# EAGLE schematic MotionBoard Rev C (EAGLE 7.5.0)

## Sheet 1 of 2
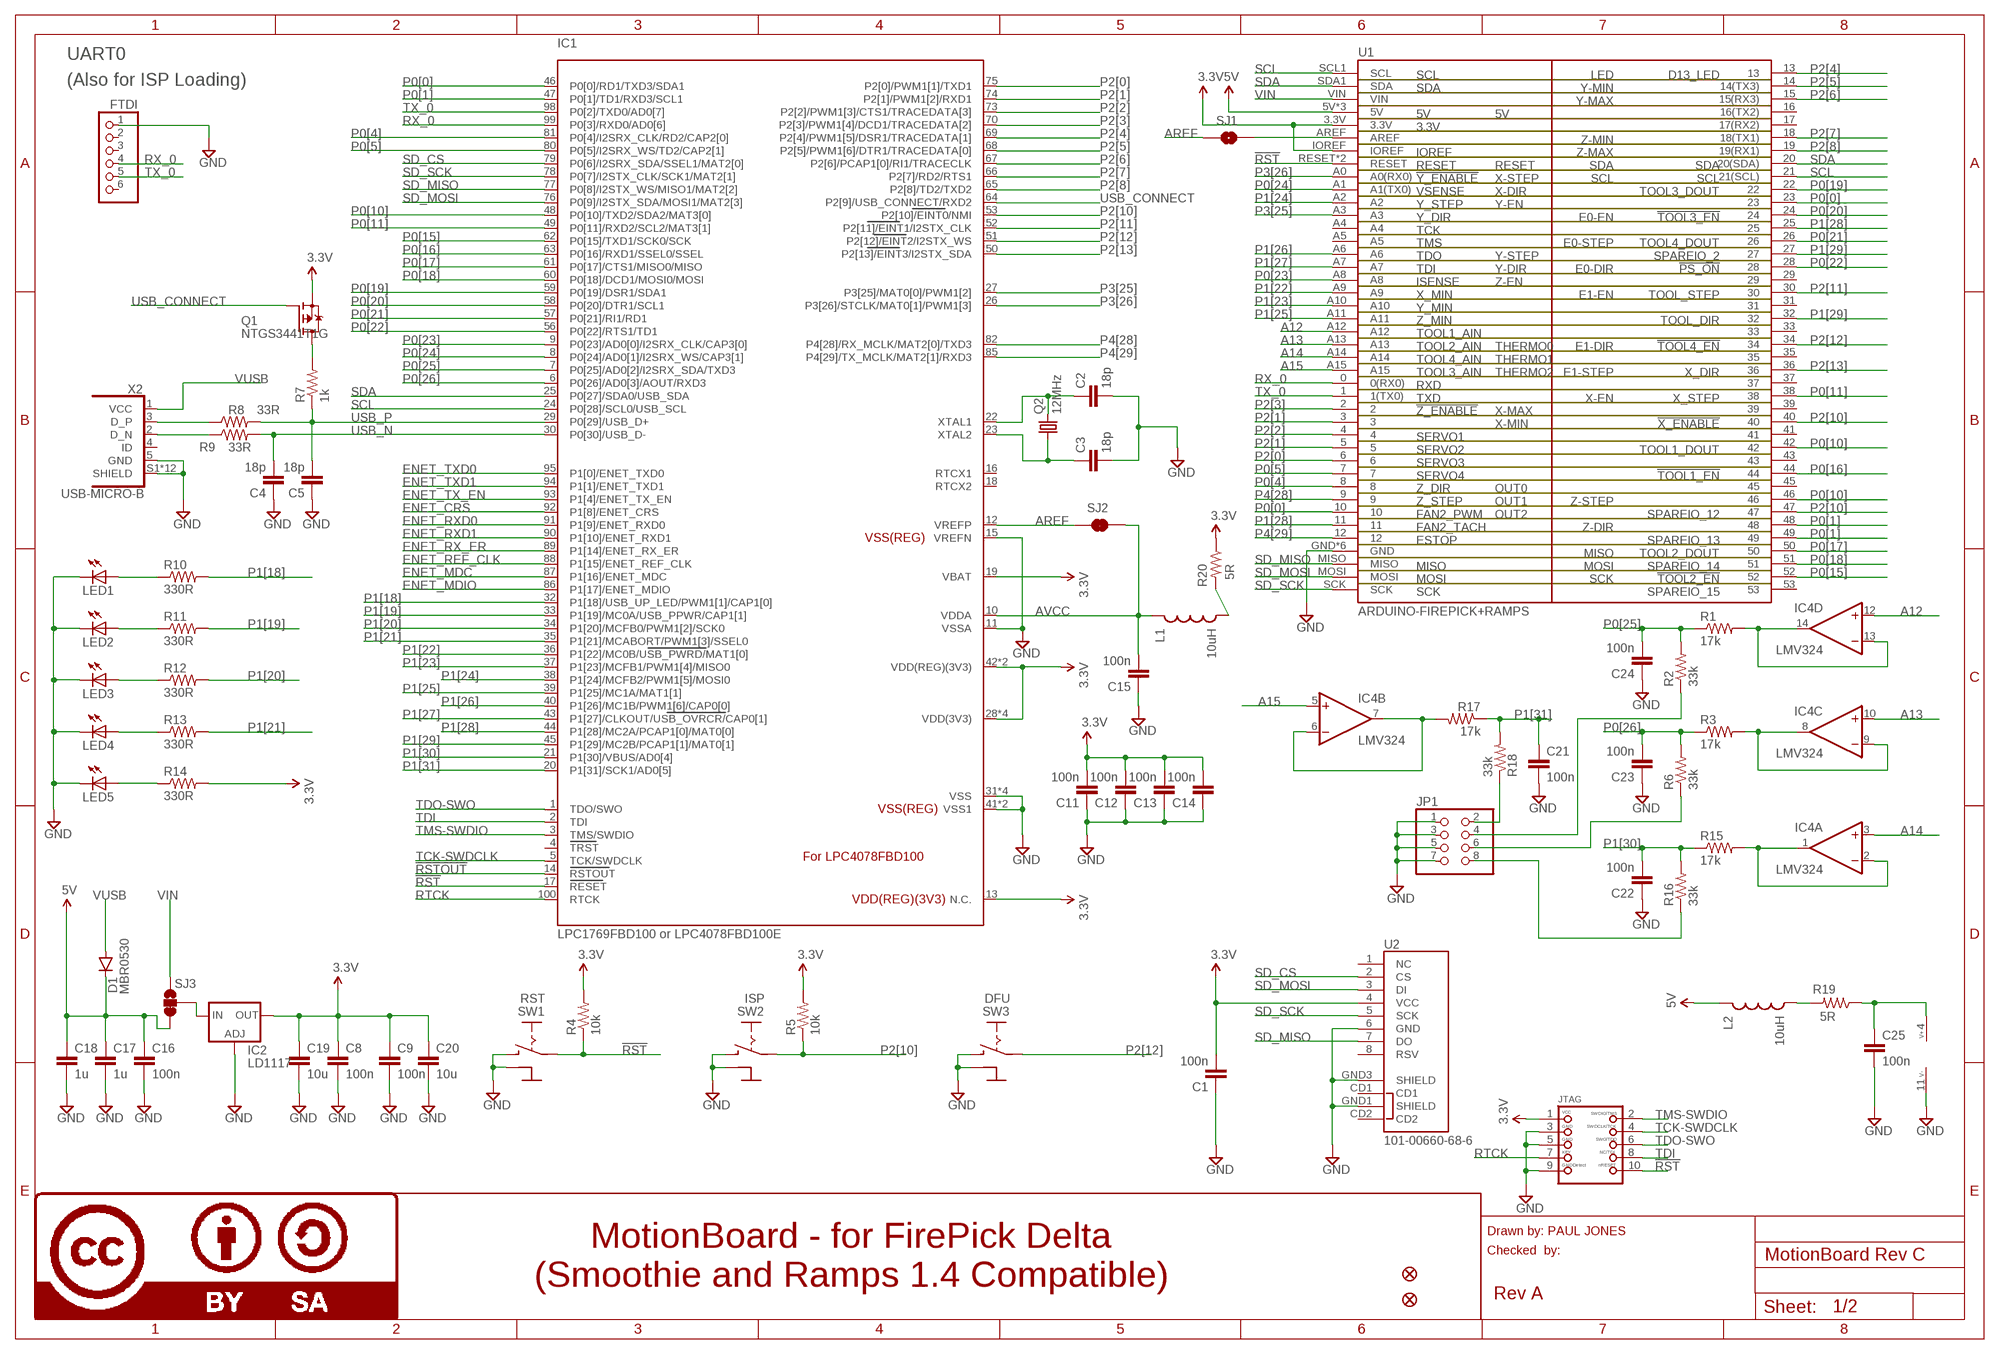
[diagram p0: schematic, sheet 1]

### Parts
C1  100n  CAP0603  [0603]
C2  18p  CAP0603  [0603]
C3  18p  CAP0603  [0603]
C4  18p  CAP0603  [0603]
C5  18p  CAP0603  [0603]
C8  100n  CAP0603  [0603]
C9  100n  CAP0603  [0603]
C11  100n  CAP0603  [0603]
C12  100n  CAP0603  [0603]
C13  100n  CAP0603  [0603]
C14  100n  CAP0603  [0603]
C15  100n  CAP0603  [0603]
C16  100n  CAP0603  [0603]
C17  1u  CAP0603  [0603]
C18  1u  CAP0603  [0603]
C19  10u  CAP0603  [0603]
C20  10u  CAP0603  [0603]
C21  100n  CAP0603  [0603]
C22  100n  CAP0603  [0603]
C23  100n  CAP0603  [0603]
C24  100n  CAP0603  [0603]
C25  100n  CAP0603  [0603]
D1  MBR0530  DIODESOD123  [SOD-123]
DFU  SW3  TOGGLE-SW-SMD  [TOGGLE-SW-SMD]
FID5  FIDUCIAL1X2  [FIDUCIAL-1X2]
FID6  FIDUCIAL1X2  [FIDUCIAL-1X2]
FTDI  PINHD-1X6  [1X06]
IC1  LPC1769FBD100 or LPC4078FBD100E  LPC1768  [LQFP100]
IC2  LD1117  LD117AS12TR  [SOT223]
IC4  LMV324  OPA4743UA  [SO14]
ISP  SW2  TOGGLE-SW-SMD  [TOGGLE-SW-SMD]
JP1  PINHD-2X04_2.54-SMD  [2X04SMD]
JTAG  JTAG-CORTEXM3  [2X05_1.27MM_SMT]
L1  10uH  INDUCTOR0603  [0603]
L2  10uH  INDUCTOR0603  [0603]
LED1  LED  [LED-1206-BOTTOM]
LED2  LED  [LED-1206-BOTTOM]
LED3  LED  [LED-1206-BOTTOM]
LED4  LED  [LED-1206-BOTTOM]
LED5  LED  [LED-1206-BOTTOM]
LOGO6  LOGO-CC-BY-SAMEDIUM  [LOGO-CC-BY-SA-MEDIUM]
Q1  NTGS3441T1G  BSL207SP  [SC74_INFINEON]
Q2  12MHz  CRYSTALHC49UP  [HC49UP]
R1  17k  RESISTOR0603  [0603]
R2  33k  RESISTOR0603  [0603]
R3  17k  RESISTOR0603  [0603]
R4  10k  R-US_R0603  [R0603]
R5  10k  R-US_R0603  [R0603]
R6  33k  RESISTOR0603  [0603]
R7  1k  R-US_R0603  [R0603]
R8  33R  R-US_R0603  [R0603]
R9  33R  R-US_R0603  [R0603]
R10  330R  R-US_R0603  [R0603]
R11  330R  R-US_R0603  [R0603]
R12  330R  R-US_R0603  [R0603]
R13  330R  R-US_R0603  [R0603]
R14  330R  R-US_R0603  [R0603]
R15  17k  RESISTOR0603  [0603]
R16  33k  RESISTOR0603  [0603]
R17  17k  RESISTOR0603  [0603]
R18  33k  RESISTOR0603  [0603]
R19  5R  RESISTOR0603  [0603]
R20  5R  RESISTOR0603  [0603]
RST  SW1  TOGGLE-SW-SMD  [TOGGLE-SW-SMD]
SJ1  JUMPER-PAD-2-NOYES_SILK  [PAD-JUMPER-2-NO_YES_SILK]
SJ2  JUMPER-PAD-2-NC_BY_TRACE  [PAD-JUMPER-2-NC_BY_TRACE_YES_SILK]
SJ3  JUMPER-PAD-3-2OF3_NC_BY_TRACE_SMALL  [PAD-JUMPER-3-2OF3_NC_BY_TRACE_YES_SILK_FULL_BOX]
U1  ARDUINO-FIREPICK+RAMPS  [ARDUINO_MEGA_NEW]
U2  101-00660-68-6  USD-SOCKETNEW  [MICRO-SD-SOCKET-PP]
X2  USB-MICRO-B  [FCI-10118194-0001LF]

### Nets
3.3V: C1.2 C8.1 C9.1 C11.2 C12.2 C13.2 C14.2 C19.1 C20.1 IC1.13(N.C.) IC1.19(VBAT) IC1.28(VDD(3V3)) IC1.42(VDD(REG)(3V3)) IC1.54(VDD(3V3)) IC1.71(VDD(3V3)) IC1.84(VDD(REG)(3V3)) IC1.96(VDD(3V3)) IC2.4(OUT) JTAG.1 Q1.4(S) R4.2 R5.2 R14.2 R20.1 U1.3.3V U1.IOREF U2.4(VCC) ; also sheet 2
5V: C16.1 C17.1 C18.1 D1.C L2.1 SJ3.3 U1.5V U1.5V@1(5V) U1.5V@2(5V)
!RST: IC1.17(RESET) JTAG.10 R4.1 RST.3(I) RST.4(I) U1.RESET U1.RST(RESET)
!RSTOUT: IC1.14(RSTOUT) ; also sheet 2
A12: IC4.12(D:+IN) U1.A12
A13: IC4.10(C:+IN) U1.A13
A14: IC4.3(A:+IN) U1.A14
A15: IC4.5(B:+IN) U1.A15
AREF: IC1.12(VREFP) SJ1.1 SJ2.1
AVCC: C15.2 IC1.10(VDDA) L1.1 SJ2.2
D_N: R9.1 X2.2(D_N)
D_P: R8.1 X2.3(D_P)
ENET_CRS: IC1.92(P1[8]/ENET_CRS) ; also sheet 2
ENET_MDC: IC1.87(P1[16]/ENET_MDC) ; also sheet 2
ENET_MDIO: IC1.86(P1[17]/ENET_MDIO) ; also sheet 2
ENET_REF_CLK: IC1.88(P1[15]/ENET_REF_CLK) ; also sheet 2
ENET_RX_ER: IC1.89(P1[14]/ENET_RX_ER) ; also sheet 2
ENET_RXD0: IC1.91(P1[9]/ENET_RXD0) ; also sheet 2
ENET_RXD1: IC1.90(P1[10]/ENET_RXD1) ; also sheet 2
ENET_TX_EN: IC1.93(P1[4]/ENET_TX_EN) ; also sheet 2
ENET_TXD0: IC1.95(P1[0]/ENET_TXD0) ; also sheet 2
ENET_TXD1: IC1.94(P1[1]/ENET_TXD1) ; also sheet 2
GND: C1.1 C2.2 C3.2 C4.1 C5.1 C8.2 C9.2 C11.1 C12.1 C13.1 C14.1 C15.1 C16.2 C17.2 C18.2 C19.2 C20.2 C21.2 C22.1 C23.1 C24.1 C25.2 DFU.1(C) DFU.2(C) DFU.GND FTDI.1 IC1.11(VSSA) IC1.15(VREFN) IC1.31(VSS) IC1.41(VSS1) IC1.55(VSS) IC1.72(VSS) IC1.83(VSS1) IC1.97(VSS) IC2.1(ADJ) IC4.11(P:V-) ISP.1(C) ISP.2(C) ISP.GND JP1.1 JP1.3 JP1.5 JP1.7 JTAG.3 JTAG.5 JTAG.9 LED1.C LED2.C LED3.C LED4.C LED5.C RST.1(C) RST.2(C) RST.GND U1.GND U1.GND@0(GND) U1.GND@1(GND) U1.GND@2(GND) U1.GND@3(GND) U1.GNDI(GND) U2.6(GND) U2.GND1(SHIELD) U2.GND3(SHIELD) X2.5(GND) X2.S1(SHIELD) X2.S2(SHIELD) X2.S3(SHIELD) X2.S4(SHIELD) X2.S5(SHIELD) X2.S6(SHIELD) X2.S7(SHIELD) X2.S8(SHIELD) X2.S9(SHIELD) X2.S10(SHIELD) X2.S11(SHIELD) X2.S12(SHIELD) ; also sheet 2
N$1: C2.1 IC1.22(XTAL1) Q2.2
N$2: C3.1 IC1.23(XTAL2) Q2.1
N$5: SJ1.2 U1.AREF
N$6: IC4.6(B:-IN) IC4.7(B:OUT) R17.2
N$7: IC2.3(IN) SJ3.2
N$8: JP1.2 R18.1
N$10: IC4.13(D:-IN) IC4.14(D:OUT) R1.2
N$11: JP1.8 R16.1
N$13: IC4.8(C:OUT) IC4.9(C:-IN) R3.2
N$14: JP1.6 R6.1
N$16: IC4.1(A:OUT) IC4.2(A:-IN) R15.2
N$17: JP1.4 R2.1
N$18: C25.1 IC4.4(P:V+) R19.1
N$19: L2.2 R19.2
N$21: L1.2 R20.2
N$51: Q1.1(D) Q1.2(D) Q1.5(D) Q1.6(D) R7.2
N$80: LED5.A R14.1
N$84: LED4.A R13.1
N$85: LED3.A R12.1
N$86: LED2.A R11.1
N$87: LED1.A R10.1
P0[0]: IC1.46(P0[0]/RD1/TXD3/SDA1) U1.10 U1.23
P0[1]: IC1.47(P0[1]/TD1/RXD3/SCL1) U1.48 U1.49
P0[4]: IC1.81(P0[4]/I2SRX_CLK/RD2/CAP2[0]) U1.8
P0[5]: IC1.80(P0[5]/I2SRX_WS/TD2/CAP2[1]) U1.7
P0[10]: IC1.48(P0[10]/TXD2/SDA2/MAT3[0]) U1.42 U1.46
P0[11]: IC1.49(P0[11]/RXD2/SCL2/MAT3[1]) U1.38
P0[15]: IC1.62(P0[15]/TXD1/SCK0/SCK) U1.52
P0[16]: IC1.63(P0[16]/RXD1/SSEL0/SSEL) U1.44
P0[17]: IC1.61(P0[17]/CTS1/MISO0/MISO) U1.50
P0[18]: IC1.60(P0[18]/DCD1/MOSI0/MOSI) U1.51
P0[19]: IC1.59(P0[19]/DSR1/SDA1) U1.22
P0[20]: IC1.58(P0[20]/DTR1/SCL1) U1.24
P0[21]: IC1.57(P0[21]/RI1/RD1) U1.26
P0[22]: IC1.56(P0[22]/RTS1/TD1) U1.28
P0[23]: IC1.9(P0[23]/AD0[0]/I2SRX_CLK/CAP3[0]) U1.A8
P0[24]: IC1.8(P0[24]/AD0[1]/I2SRX_WS/CAP3[1]) U1.A1(A1(TX0))
P0[25]: C24.2 IC1.7(P0[25]/AD0[2]/I2SRX_SDA/TXD3) R1.1 R2.2
P0[26]: C23.2 IC1.6(P0[26]/AD0[3]/AOUT/RXD3) R3.1 R6.2
P1[18]: IC1.32(P1[18]/USB_UP_LED/PWM1[1]/CAP1[0]) R10.2
P1[19]: IC1.33(P1[19]/MC0A/USB_PPWR/CAP1[1]) R11.2
P1[20]: IC1.34(P1[20]/MCFB0/PWM1[2]/SCK0) R12.2
P1[21]: IC1.35(P1[21]/MCABORT/PWM1[3]/SSEL0) R13.2
P1[22]: IC1.36(P1[22]/MC0B/USB_PWRD/MAT1[0]) U1.A9
P1[23]: IC1.37(P1[23]/MCFB1/PWM1[4]/MISO0) U1.A10
P1[24]: IC1.38(P1[24]/MCFB2/PWM1[5]/MOSI0) U1.A2
P1[25]: IC1.39(P1[25]/MC1A/MAT1[1]) U1.A11
P1[26]: IC1.40(P1[26]/MC1B/PWM1[6]/CAP0[0]) U1.A6
P1[27]: IC1.43(P1[27]/CLKOUT/USB_OVRCR/CAP0[1]) U1.A7
P1[28]: IC1.44(P1[28]/MC2A/PCAP1[0]/MAT0[0]) U1.11 U1.25
P1[29]: IC1.45(P1[29]/MC2B/PCAP1[1]/MAT0[1]) U1.27 U1.32
P1[30]: C22.2 IC1.21(P1[30]/VBUS/AD0[4]) R15.1 R16.2
P1[31]: C21.1 IC1.20(P1[31]/SCK1/AD0[5]) R17.1 R18.2
P2[0]: IC1.75(P2[0]/PWM1[1]/TXD1) U1.6
P2[1]: IC1.74(P2[1]/PWM1[2]/RXD1) U1.3 U1.5
P2[2]: IC1.73(P2[2]/PWM1[3]/CTS1/TRACEDATA[3]) U1.4
P2[3]: IC1.70(P2[3]/PWM1[4]/DCD1/TRACEDATA[2]) U1.2
P2[4]: IC1.69(P2[4]/PWM1[5]/DSR1/TRACEDATA[1]) U1.13
P2[5]: IC1.68(P2[5]/PWM1[6]/DTR1/TRACEDATA[0]) U1.14(14(TX3))
P2[6]: IC1.67(P2[6]/PCAP1[0]/RI1/TRACECLK) U1.15(15(RX3))
P2[7]: IC1.66(P2[7]/RD2/RTS1) U1.18(18(TX1))
P2[8]: IC1.65(P2[8]/TD2/TXD2) U1.19(19(RX1))
P2[10]: IC1.53(P2[10]/EINT0/NMI) ISP.3(I) ISP.4(I) R5.1 U1.40 U1.47
P2[11]: IC1.52(P2[11]/EINT1/I2STX_CLK) U1.30
P2[12]: DFU.3(I) DFU.4(I) IC1.51(P2[12]/EINT2/I2STX_WS) U1.34
P2[13]: IC1.50(P2[13]/EINT3/I2STX_SDA) U1.36
P3[25]: IC1.27(P3[25]/MAT0[0]/PWM1[2]) U1.A3
P3[26]: IC1.26(P3[26]/STCLK/MAT0[1]/PWM1[3]) U1.A0(A0(RX0))
P4[28]: IC1.82(P4[28]/RX_MCLK/MAT2[0]/TXD3) U1.9
P4[29]: IC1.85(P4[29]/TX_MCLK/MAT2[1]/RXD3) U1.12
RTCK: IC1.100(RTCK) JTAG.7
RX_0: FTDI.4 IC1.99(P0[3]/RXD0/AD0[6]) U1.0(0(RX0))
SCL: IC1.24(P0[28]/SCL0/USB_SCL) U1.21(21(SCL)) U1.SCL1(SCL)
SD_CS: IC1.79(P0[6]/I2SRX_SDA/SSEL1/MAT2[0]) U2.2(CS)
SD_MISO: IC1.77(P0[8]/I2STX_WS/MISO1/MAT2[2]) U1.MISO U2.7(DO)
SD_MOSI: IC1.76(P0[9]/I2STX_SDA/MOSI1/MAT2[3]) U1.MOSI U2.3(DI)
SD_SCK: IC1.78(P0[7]/I2STX_CLK/SCK1/MAT2[1]) U1.SCK U2.5(SCK)
SDA: IC1.25(P0[27]/SDA0/USB_SDA) U1.20(20(SDA)) U1.SDA1(SDA)
TCK-SWDCLK: IC1.5(TCK/SWDCLK) JTAG.4
TDI: IC1.2(TDI) JTAG.8
TDO-SWO: IC1.1(TDO/SWO) JTAG.6
TMS-SWDIO: IC1.3(TMS/SWDIO) JTAG.2
TX_0: FTDI.5 IC1.98(P0[2]/TXD0/AD0[7]) U1.1(1(TX0))
USB_CONNECT: IC1.64(P2[9]/USB_CONNECT/RXD2) Q1.3(G)
USB_N [USB]: C4.2 IC1.30(P0[30]/USB_D-) R9.2
USB_P [USB]: C5.2 IC1.29(P0[29]/USB_D+) R7.1 R8.2
VIN: SJ3.1 U1.VIN
VUSB: D1.A X2.1(VCC)
Unconnected: FTDI.2 FTDI.3 FTDI.6 IC1.4(TRST) IC1.16(RTCX1) IC1.18(RTCX2) U1.16(16(TX2)) U1.17(17(RX2)) U1.29 U1.31 U1.33 U1.35 U1.37 U1.39 U1.41 U1.43 U1.45 U1.53 U1.A4 U1.A5 U2.1(NC) U2.8(RSV) U2.CD1 U2.CD2 X2.4(ID)

### Notes on the sheet
- UART0
- (Also for ISP Loading)
- Drawn by: PAUL JONES
- MotionBoard - for FirePick Delta
  (Smoothie and Ramps 1.4 Compatible)
- Checked  by:
- Rev A

## Sheet 2 of 2
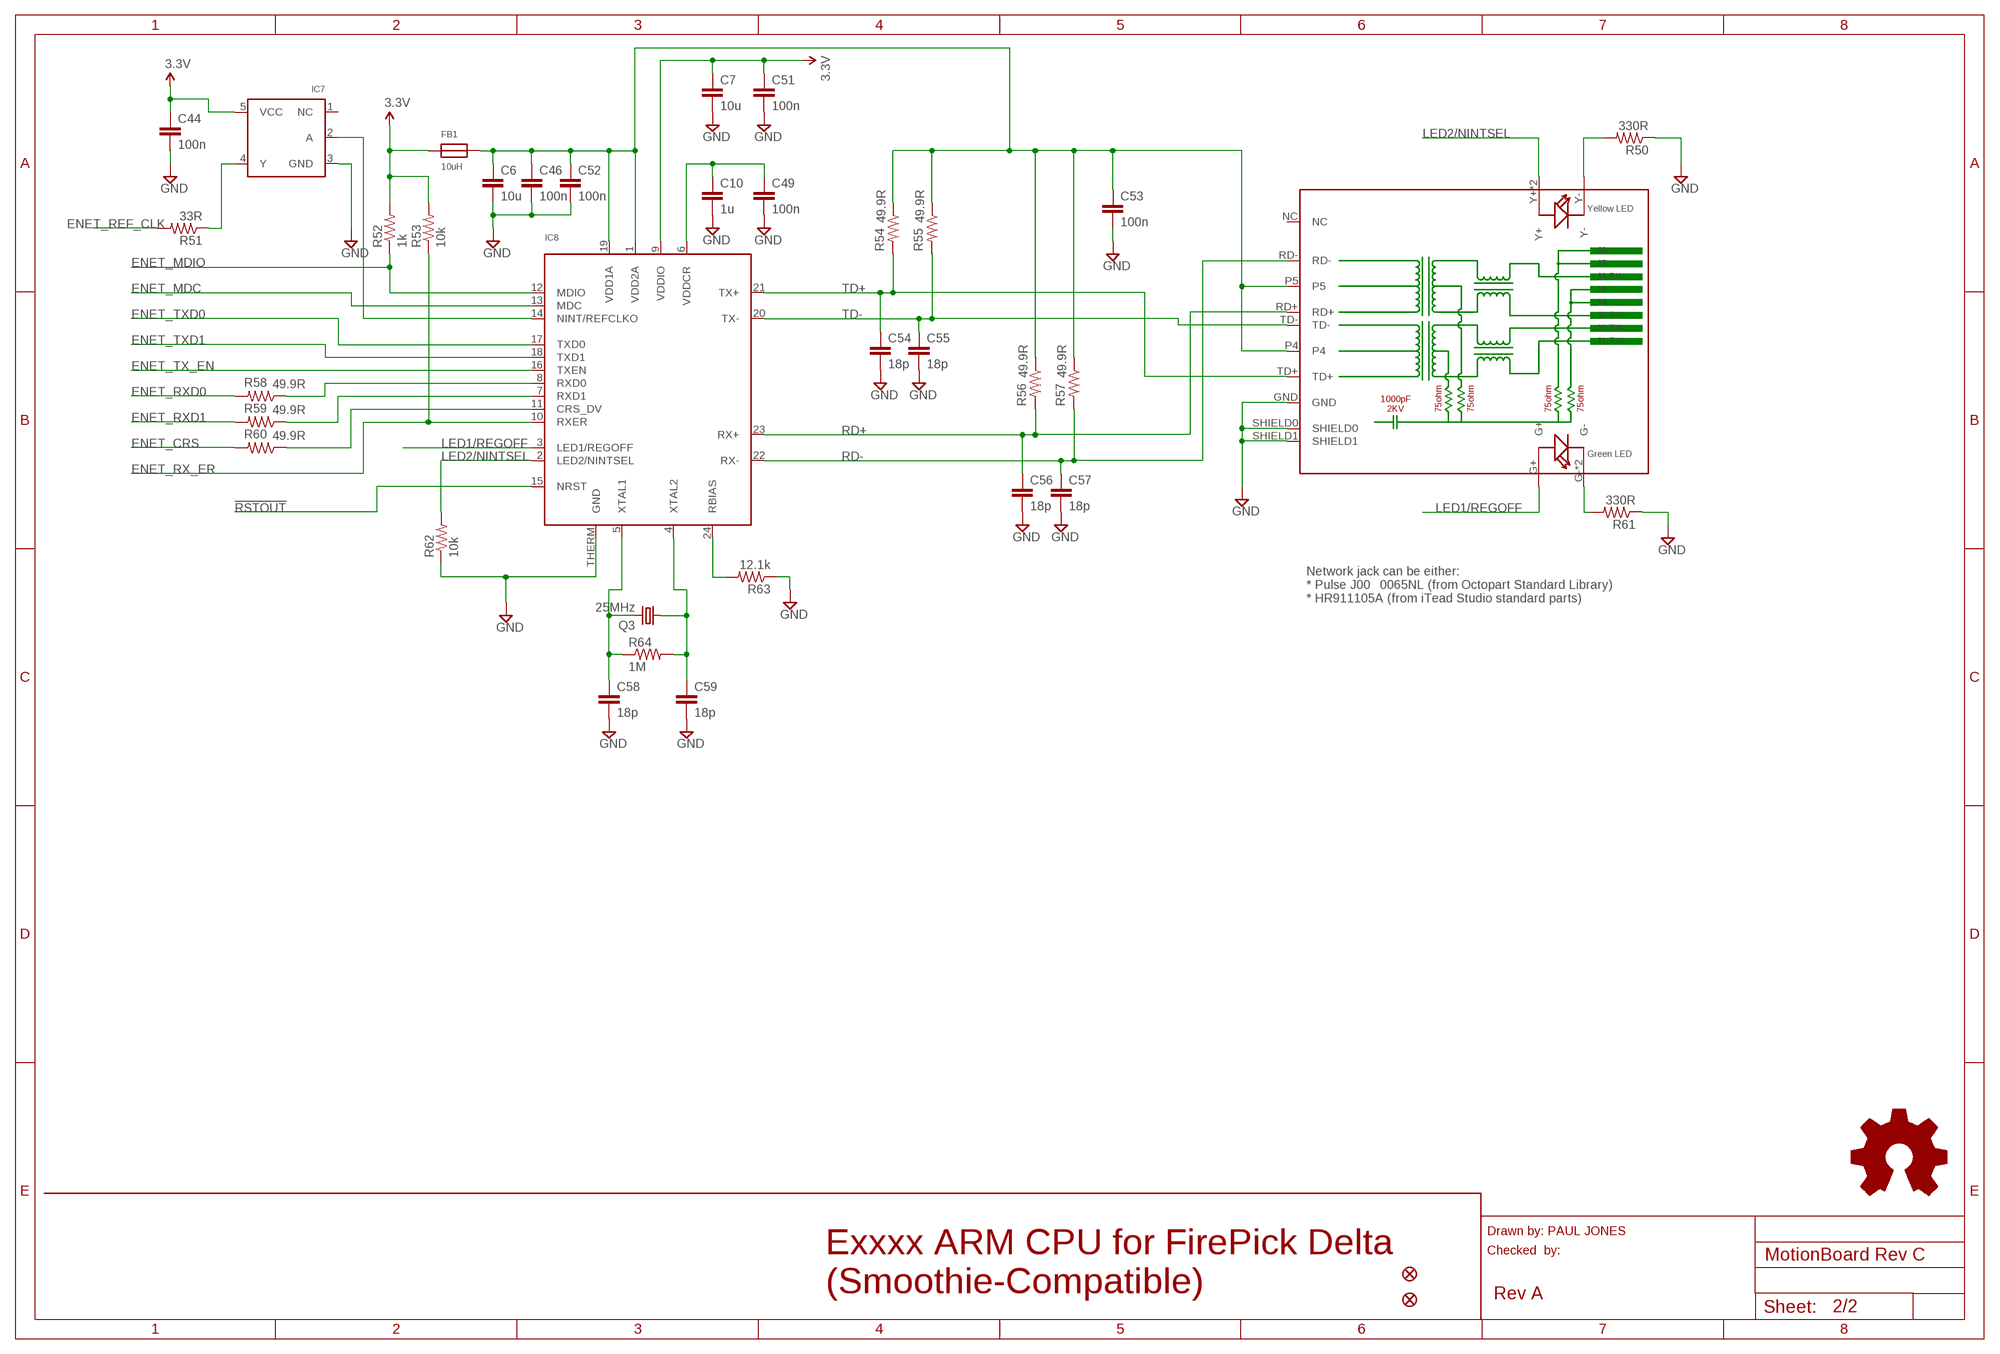
[diagram p1: schematic, sheet 2]

### Parts
C6  10u  CAP0603  [0603]
C7  10u  CAP0603  [0603]
C10  1u  CAP0603  [0603]
C44  100n  CAP0603  [0603]
C46  100n  CAP0603  [0603]
C49  100n  CAP0603  [0603]
C51  100n  CAP0603  [0603]
C52  100n  CAP0603  [0603]
C53  100n  CAP0603  [0603]
C54  18p  CAP0603  [0603]
C55  18p  CAP0603  [0603]
C56  18p  CAP0603  [0603]
C57  18p  CAP0603  [0603]
C58  18p  CAP0603  [0603]
C59  18p  CAP0603  [0603]
FB1  10uH  FERRITE  [0603]
FID17  FIDUCIAL1X2  [FIDUCIAL-1X2]
FID18  FIDUCIAL1X2  [FIDUCIAL-1X2]
IC7  74LVC1G04  [SOT23-5]
IC8  LAN8720  [QFN24_4MM]
LOGO10  LOGO-OSHWSMALL  [LOGO-OSHW-SMALL]
Q3  25MHz  CRYSTALHC49UP  [HC49UP]
R50  330R  R-US_R0603  [R0603]
R51  33R  R-US_R0603  [R0603]
R52  1k  R-US_R0603  [R0603]
R53  10k  R-US_R0603  [R0603]
R54  49.9R  R-US_R0603  [R0603]
R55  49.9R  R-US_R0603  [R0603]
R56  49.9R  R-US_R0603  [R0603]
R57  49.9R  R-US_R0603  [R0603]
R58  49.9R  R-US_R0603  [R0603]
R59  49.9R  R-US_R0603  [R0603]
R60  49.9R  R-US_R0603  [R0603]
R61  330R  R-US_R0603  [R0603]
R62  10k  R-US_R0603  [R0603]
R63  12.1k  R-US_R0603  [R0603]
R64  1M  R-US_R0603  [R0603]
RJ1  HR911105A  [HR911105A]

### Nets
3.3V: C7.1 C44.1 C51.1 FB1.1 IC7.5(VCC) IC8.9(VDDIO) R52.2 R53.2 ; also sheet 1
!RSTOUT: IC8.15(NRST) ; also sheet 1
ENET_CRS: R60.2 ; also sheet 1
ENET_MDC: IC8.13(MDC) ; also sheet 1
ENET_MDIO: IC8.12(MDIO) R52.1 ; also sheet 1
ENET_REF_CLK: R51.2 ; also sheet 1
ENET_RX_ER: IC8.10(RXER) R53.1 ; also sheet 1
ENET_RXD0: R58.2 ; also sheet 1
ENET_RXD1: R59.2 ; also sheet 1
ENET_TX_EN: IC8.16(TXEN) ; also sheet 1
ENET_TXD0: IC8.17(TXD0) ; also sheet 1
ENET_TXD1: IC8.18(TXD1) ; also sheet 1
GND: C6.2 C7.2 C10.2 C44.2 C46.2 C49.2 C51.2 C52.2 C53.2 C54.2 C55.2 C56.2 C57.2 C58.2 C59.2 IC7.3(GND) IC8.THERM(GND) R50.1 R61.1 R62.1 R63.1 RJ1.GND RJ1.SHIELD0 RJ1.SHIELD1 ; also sheet 1
LED1/REGOFF: IC8.3(LED1/REGOFF) RJ1.G+
LED2/NINTSEL: IC8.2(LED2/NINTSEL) R62.2 RJ1.Y+ RJ1.Y++(Y+)
N$3: IC8.11(CRS_DV) R60.1
N$4: IC8.24(RBIAS) R63.2
N$12: C10.1 C49.1 IC8.6(VDDCR)
N$15: IC7.2(A) IC8.14(NINT/REFCLKO)
N$20: R61.2 RJ1.G- RJ1.G--(G-)
N$42: IC8.8(RXD0) R58.1
N$47: R50.2 RJ1.Y-
N$55: IC8.7(RXD1) R59.1
N$67: C59.1 IC8.4(XTAL2) Q3.1 R64.2
N$68: C58.1 IC8.5(XTAL1) Q3.2 R64.1
N$78: IC7.4(Y) R51.1
RD+: C56.1 IC8.23(RX+) R56.2 RJ1.RD+
RD-: C57.1 IC8.22(RX-) R57.2 RJ1.RD-
TD+: C54.1 IC8.21(TX+) R54.2 RJ1.TD+
TD-: C55.1 IC8.20(TX-) R55.2 RJ1.TD-
VDD: C6.1 C46.1 C52.1 C53.1 FB1.2 IC8.1(VDD2A) IC8.19(VDD1A) R54.1 R55.1 R56.1 R57.1 RJ1.P4 RJ1.P5
Unconnected: IC7.1(NC) RJ1.NC

### Notes on the sheet
- Network jack can be either:
  * Pulse J00‑0065NL (from Octopart Standard Library)
  * HR911105A (from iTead Studio standard parts)
- Drawn by: PAUL JONES
- Checked  by:
- Exxxx ARM CPU for FirePick Delta
  (Smoothie-Compatible)
- Rev A

## Library data of the parts
C1-C25 C44 C46 C49 C51-C59 = Paul:CAP: Capacitor Standard 0603 ceramic capacitor, and 0.1" leaded capacitor.
D1 = SparkFun-DiscreteSemi:DIODE: Diode These are standard reverse protection diodes and small signal diodes. SMA package can handle up to about 1A. SOD-323 can handle about 200mA. What the SOD-323 package when ordering, there are some mfgs out there that are 5-pin packages.
DFU ISP RST = Paul:TOGGLE-SW-SMD
FB1 = microbuilder:FERRITE: Ferrite Bead 0603 120 Ohm, 600mA Ferrite Chip - Digikey: 445-2164-1-ND
FID5 FID6 FID17 FID18 = SparkFun-Aesthetics:FIDUCIAL: Fiducial Alignment Points Various fiducial points for machine vision alignment.
FTDI = pinhead:PINHD-1X6: PIN HEADER
IC1 = Paul:LPC1768: LPC1768 100 MHz 32-bit ARM Cortex-M3 based microcontroller featuring a high level of integration and low power consumption. 512 kB Flash, 64 kB SRAM, USB Device/Host/OTG, Ethernet, CAN, I2S, 10-bit DAC Digikey: 568-4796-ND
IC2 = v-reg:LD117A?*: Low drop fixed and adjustable positive voltage regulators 1 A Source: http://www.st.com/stonline/products/literature/ds/7194/ld1117axx.pdf
IC4 = Paul:OPA4743: 12V, 7MHz, CMOS, Rail-to-Rail I/O Quad OP AMP Source: http://focus.ti.com/lit/ds/sbos201/sbos201.pdf
IC7 = microbuilder:74LVC1G04: 74LVC1G04 - Single Inverter Gate SOT23-5 SN74LVC1G04DBVR - Digikey: 296-11599-1-ND
IC8 = microbuilder:LAN8720: LAN8720A 10/100 Ethernet PHY Mouser: 886-LAN8720AI-CP
JP1 = pinhead-2:PINHD-2X04: PIN HEADER
JTAG = microbuilder:JTAG-CORTEXM3: Serial Wire (SW-DP) Connector This standard 0.05" 10-pin connector is for use with the Cortex M0/M3's native SWD (serial wire debugger) interface (SW-DP). Some boards support a 20-pin combined JTAG+SWD connector (SWJ-DP), such as the LPC1700 family, but many smaller devices only work with SWD which typically use the smaller 10-pin SW-DP connecter (the LPC1300 family, for example, only supports SWD). 2x05 1.27mm/0.05" Connector: This is the standard SMT connector defined by ARM for all Cortex devices, and should be used in most situations and for forward-compatibility since any new devices coming to market will likely use this connector. MOLEX 10 Pin 0.1" Connector: This 0.1" 10 pin connector has the same pin layout as the standard 0.05" connector, but is easier to work with if you are using standard jumper wires or custom cables to connect your SWD hardware. MOLEX 20 Pin 0.1" Connector: This 0.1" 20 pin connector is the same model used for ARM7/ARM9 JTAG debuggers, but is connected to match the pins on the Segger J-Link for ARM (which supports both JTAG and SWD debugging). See the following document from ARM for more information on Cortex M3 Debug Connectors: http://infocenter.arm.com/help/topic/com.arm.doc.faqs/attached/13634/cortex_debug_connectors.pdf And the following page for an overview with images of the different connector types: http://www.keil.com/peripherals/coresight/connectors.asp
L1 L2 = SparkFun:INDUCTOR: Inductors Basic Inductor/Choke - 0603 and 1206. Footprints are not proven and vary greatly between part numbers.
LED1-LED5 = Paul:LED: LEDs Standard schematic elements and footprints for 5mm, 3mm, 1206, and 0603 sized LEDs. 5mm - Spark Fun Electronics SKU : COM-00529 (and others)
LOGO6 = FirePick:LOGO-CC-BY-SA
LOGO10 = FirePick:LOGO-OSHW
Q1 = transistor-fet:BSL207SP: OptiMOS(R)-P Small-Signal-Transistor P-Channel, Enhancement mode, Super Logic Level (2.5 V rated) Source: http://www.infineon.com/upload/Document/BSL207SP_Rev2.01.pdf
Q2 Q3 = crystal:CRYSTAL: CRYSTAL; OC_FARNELL: unknown; OC_NEWARK: unknown
R1-R3 R6 R15-R20 = Paul:RESISTOR: Resistor Basic schematic elements and footprints for 0603, 1206, and PTH 1/10th watt (small) resistors.
R4 R5 R7-R14 R50-R64 = resistor:R-US_: RESISTOR, American symbol
RJ1 = Paul:HR911105A: SOC006
SJ1 = SparkFun-Passives:JUMPER-PAD-2-NO
SJ2 = SparkFun-Passives:JUMPER-PAD-2-NC_BY_TRACE
SJ3 = SparkFun-Passives:JUMPER-PAD-3-2OF3_NC_BY_TRACE
U1 = Paul:ARDUINO-FIREPICK+RAMPS
U2 = SparkFun-Connectors:USD-SOCKET: microSD Socket Push-push type uSD socket. Schematic element and footprint production proven. Spark Fun Electronics SKU : PRT-00127. tDoc lines correctly indicate media card edge positions when inserting (unlocked, locked, depressed). NOTE: CD1 and CD2 are connected internally; PROD_ID: CONN-07820
X2 = Paul:USB-MICRO-B

## Net classes
1 USB: width 0.305 mm, drill 0.356 mm, clearance 0.254 mm
2 D: width 0.305 mm, drill 0.356 mm, clearance 0.254 mm